# Altium schematic sheet Buck (24-5V).SchDoc (part 2 of 3)
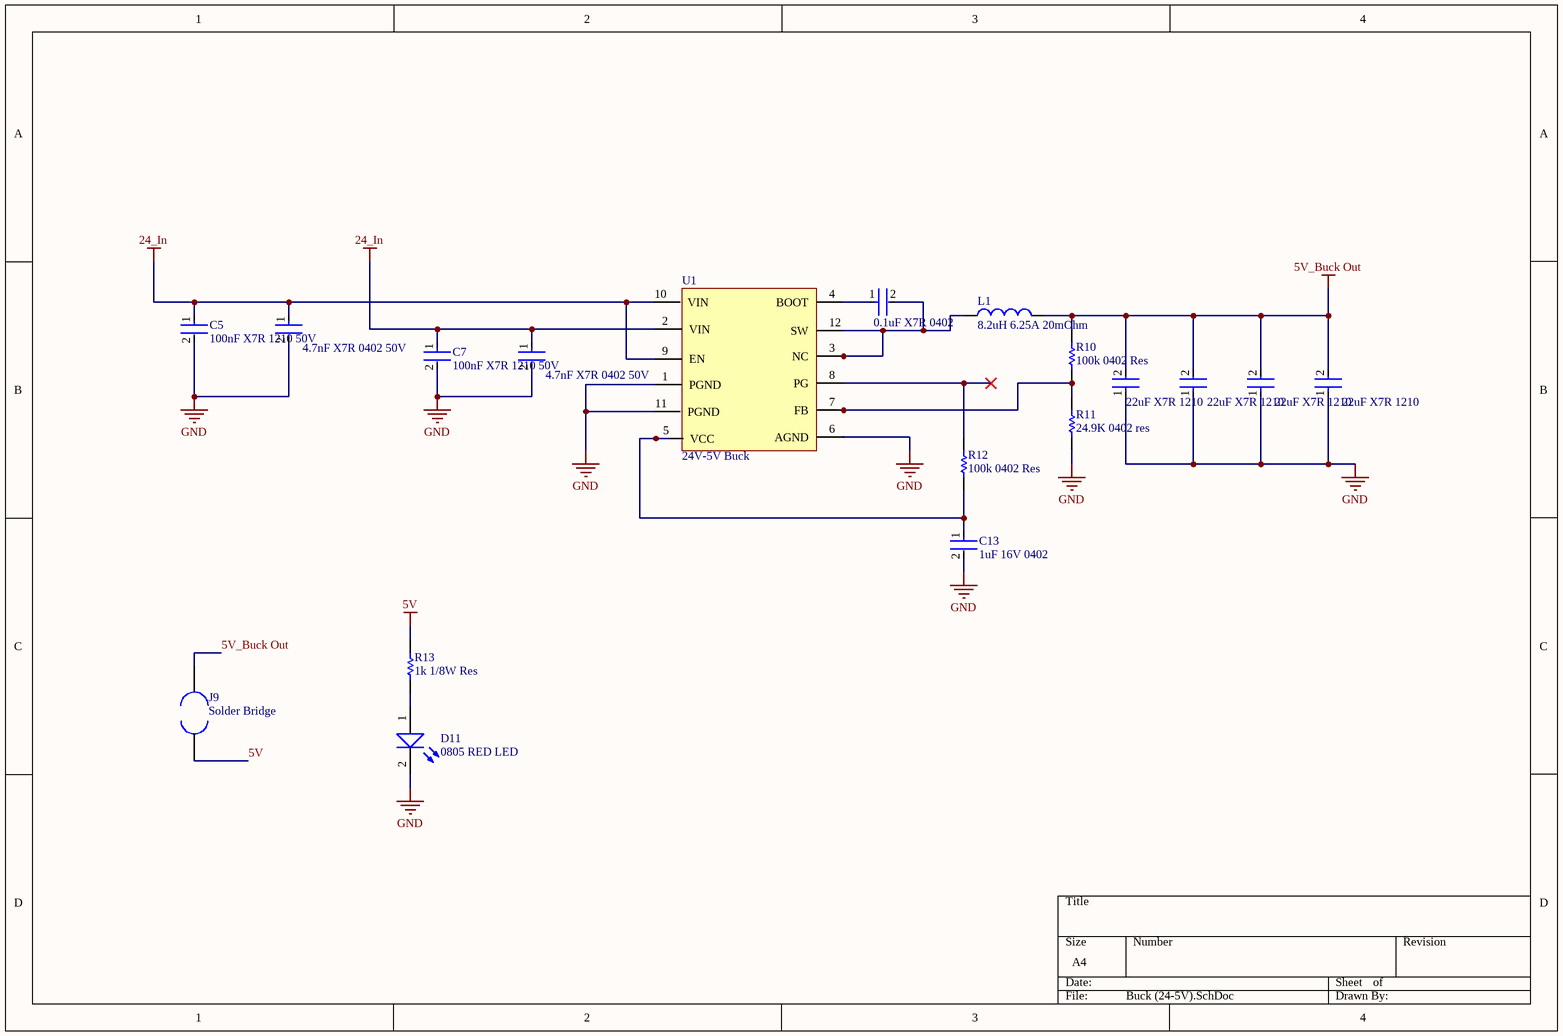
[diagram p1: Buck (24-5V).SchDoc]
## Library data of the parts
C4 = GCM155R71H104KE02J: 50V 100nF X7R ±10% 0402 Multilayer Ceramic Capacitors MLCC - SMD/SMT ROHS; Manufacturer: Murata; Manufacturer Lifecycle Status: IN PRODUCTION; Supplier: Arrow Electronics; Supplier Part Number: GCM155R71H104KE02J; Manufacturer Part Number: GCM155R71H104KE02J; RoHS: Compliant; Category: Ceramic Capacitors; Stock: 2050000; Pricing: 50000=0.008, 100000=0.0078 (USD); Value: 100nF; Case/Package: 0402; Case Code (Imperial): 0402; Case Code (Metric): 1005; Country of Origin: Philippines; Dielectric: X7R; Dielectric Material: Ceramic; Export Control Classification Number (ECCN) Code: EAR99; Height: 500µm; Harmonized Tariff Schedule (HTS) Code: 8532.24.00.20; Introduction Date: 2013-11-20; Length: 1mm; Lifecycle Status: Production; Material: Ceramic; Max Operating Temperature: 125°C; Min Operating Temperature: -55°C; Mounting Technology: Surface Mount; Number of Terminals: 2; Packaging: Tape & Reel (TR); Ratings: AEC-Q200; REACH SVHC: Yes; Schedule B: 8532240020, 8532240020|8532240020, 8532240020|8532240020|8532240020, 8532240020|8532240020|8532240020|8532240020; Termination: SMD/SMT; Tolerance: 10%; Voltage Rating: 50V; Voltage Rating (DC): 50V; Weight: 6.010099mg; Width: 500µm; ComponentLink1URL: https://datasheet.octopart.com:443/GCM155R71H104KE02J-Murata-datasheet-155345015.pdf?src-supplier=Newark; ComponentLink1Description: https://datasheet.octopart.com:443/GCM155R71H104KE02J-Murata-datasheet-155345015.pdf?src-supplier=Newark; ComponentLink2URL: https://datasheet.octopart.com:443/GCM155R71H104KE02J-Murata-datasheet-178519985.pdf?src-supplier=Arrow.cn; ComponentLink2Description: https://datasheet.octopart.com:443/GCM155R71H104KE02J-Murata-datasheet-178519985.pdf?src-supplier=Arrow.cn; ComponentLink3URL: https://datasheet.octopart.com:443/GCM155R71H104KE02J-Murata-datasheet-141266224.pdf?src-supplier=Ciiva; ComponentLink3Description: https://datasheet.octopart.com:443/GCM155R71H104KE02J-Murata-datasheet-141266224.pdf?src-supplier=Ciiva; ComponentLink4URL: https://datasheet.octopart.com:443/GCM155R71H104KE02J-Murata-datasheet-140656751.pdf?src-supplier=Ciiva; ComponentLink4Description: https://datasheet.octopart.com:443/GCM155R71H104KE02J-Murata-datasheet-140656751.pdf?src-supplier=Ciiva; ComponentLink5URL: https://datasheet.octopart.com:443/GCM155R71H104KE02J-Murata-datasheet-138716456.pdf?src-supplier=Ciiva; ComponentLink5Description: https://datasheet.octopart.com:443/GCM155R71H104KE02J-Murata-datasheet-138716456.pdf?src-supplier=Ciiva; ComponentLink6URL: https://datasheet.octopart.com:443/GCM155R71H104KE02J-Murata-datasheet-77992203.pdf?src-supplier=Future+Electronics; ComponentLink6Description: https://datasheet.octopart.com:443/GCM155R71H104KE02J-Murata-datasheet-77992203.pdf?src-supplier=Future+Electronics; ComponentLink7URL: https://datasheet.octopart.com:443/GCM155R71H104KE02J-Murata-datasheet-12511495.pdf?src-supplier=TME; ComponentLink7Description: https://datasheet.octopart.com:443/GCM155R71H104KE02J-Murata-datasheet-12511495.pdf?src-supplier=TME; ComponentLink8URL: http://sigma.octopart.com:80/reach_statement/Murata-company-16.pdf?src-supplier=Compliance+Statements; ComponentLink8Description: http://sigma.octopart.com:80/reach_statement/Murata-company-16.pdf?src-supplier=Compliance+Statements; LCSC Part No: C2649549
C5 C7 = CC1210KKX7R9BB104: 50V 100nF X7R ±10% 1210 Multilayer Ceramic Capacitors MLCC - SMD/SMT ROHS; Manufacturer: Yageo Group; Supplier: DigiKey; Supplier Part Number: 311-4522-1-ND; Manufacturer Part Number: CC1210KKX7R9BB104; RoHS: Compliant; Category: Ceramic Capacitors; Stock: 13190; Pricing: 1=0.49, 10=0.296, 50=0.221, 100=0.1979, 500=0.15896, 1000=0.14693 (USD); Value: 100nF; Case/Package: 1210; Case Code (Imperial): 1210; Case Code (Metric): 3225; China RoHS: Compliant; Composition: Ceramic; Depth: 2.5mm; Dielectric: X7R; Dielectric Material: Ceramic; Halogen Free: Halogen Free; Height: 850µm; Lead Free: Lead Free; Length: 3.2mm; Lifecycle Status: Production; Max Operating Temperature: 125°C; Min Operating Temperature: -55°C; Mounting Technology: Surface Mount; Number of Terminals: 2; Packaging: Tape and Reel; Radiation Hardening: No; REACH SVHC: Yes; Schedule B: 8532240020, 8532240020|8532240020|8532240020|8532240020|8532240020; Termination: SMD/SMT; Thickness: 939.8µm; Tolerance: 10%; Voltage Rating: 50V; Voltage Rating (DC): 50V; Width: 2.5mm; ComponentLink1URL: https://datasheet.octopart.com:443/CC1210KKX7R9BB104-Yageo-datasheet-177165144.pdf?src-supplier=IHS; ComponentLink1Description: https://datasheet.octopart.com:443/CC1210KKX7R9BB104-Yageo-datasheet-177165144.pdf?src-supplier=IHS; ComponentLink2URL: https://datasheet.octopart.com:443/CC1210KKX7R9BB104-Yageo-Group-datasheet-189192896.pdf?src-supplier=Future+Electronics; ComponentLink2Description: https://datasheet.octopart.com:443/CC1210KKX7R9BB104-Yageo-Group-datasheet-189192896.pdf?src-supplier=Future+Electronics; ComponentLink3URL: https://datasheet.octopart.com:443/CC1210KKX7R9BB104-Yageo-datasheet-166511530.pdf?src-supplier=Future+Electronics; ComponentLink3Description: https://datasheet.octopart.com:443/CC1210KKX7R9BB104-Yageo-datasheet-166511530.pdf?src-supplier=Future+Electronics; ComponentLink4URL: https://datasheet.octopart.com:443/CC1210KKX7R9BB104-Yageo-datasheet-137700082.pdf?src-supplier=Future+Electronics; ComponentLink4Description: https://datasheet.octopart.com:443/CC1210KKX7R9BB104-Yageo-datasheet-137700082.pdf?src-supplier=Future+Electronics; ComponentLink5URL: https://datasheet.octopart.com:443/CC1210KKX7R9BB104-Yageo-datasheet-137700084.pdf?src-supplier=Future+Electronics; ComponentLink5Description: https://datasheet.octopart.com:443/CC1210KKX7R9BB104-Yageo-datasheet-137700084.pdf?src-supplier=Future+Electronics; ComponentLink6URL: https://datasheet.octopart.com:443/CC1210KKX7R9BB104-Yageo-datasheet-27626582.pdf?src-supplier=Future+Electronics; ComponentLink6Description: https://datasheet.octopart.com:443/CC1210KKX7R9BB104-Yageo-datasheet-27626582.pdf?src-supplier=Future+Electronics; ComponentLink7URL: https://datasheet.octopart.com:443/CC1210KKX7R9BB104-Yageo-datasheet-15895757.pdf?src-supplier=Future+Electronics; ComponentLink7Description: https://datasheet.octopart.com:443/CC1210KKX7R9BB104-Yageo-datasheet-15895757.pdf?src-supplier=Future+Electronics; ComponentLink8URL: https://datasheet.octopart.com:443/CC1210KKX7R9BB104-Yageo-datasheet-181971219.pdf?src-supplier=Newark; ComponentLink8Description: https://datasheet.octopart.com:443/CC1210KKX7R9BB104-Yageo-datasheet-181971219.pdf?src-supplier=Newark; ComponentLink9URL: https://datasheet.octopart.com/CC1210KKX7R9BB104-Yageo-datasheet-10883670.pdf; ComponentLink9Description: https://datasheet.octopart.com/CC1210KKX7R9BB104-Yageo-datasheet-10883670.pdf; ComponentLink10URL: https://datasheet.octopart.com/CC1210KKX7R9BB104-Yageo-datasheet-12526321.pdf; ComponentLink10Description: https://datasheet.octopart.com/CC1210KKX7R9BB104-Yageo-datasheet-12526321.pdf; ComponentLink11URL: https://datasheet.octopart.com:443/CC1210KKX7R9BB104-Yageo-Group-datasheet-165992755.pdf?src-supplier=ODG+(Origin+Data+Global); ComponentLink11Description: https://datasheet.octopart.com:443/CC1210KKX7R9BB104-Yageo-Group-datasheet-165992755.pdf?src-supplier=ODG+(Origin+Data+Global); ComponentLink12URL: http://sigma.octopart.com:80/rohs_statement/Surface-Mount-Ceramic-Multilayer-Capacitors%3B-General-Purpose-%26-High-Capacitance-Class-2%2C-X7R-Yageo-family-124.pdf?src-supplier=Compliance+Statements; ComponentLink12Description: http://sigma.octopart.com:80/rohs_statement/Surface-Mount-Ceramic-Multilayer-Capacitors%3B-General-Purpose-%26-High-Capacitance-Class-2%2C-X7R-Yageo-family-124.pdf?src-supplier=Compliance+Statements; ComponentLink13URL: http://sigma.octopart.com:80/reach_statement/Surface-Mount-Ceramic-Multilayer-Capacitors%3B-General-Purpose-%26-High-Capacitance-Class-2%2C-X7R-Yageo-family-125.pdf?src-supplier=Compliance+Statements; ComponentLink13Description: http://sigma.octopart.com:80/reach_statement/Surface-Mount-Ceramic-Multilayer-Capacitors%3B-General-Purpose-%26-High-Capacitance-Class-2%2C-X7R-Yageo-family-125.pdf?src-supplier=Compliance+Statements; ComponentLink14URL: http://sigma.octopart.com:80/conflict_mineral_statement/Yageo-company-3.pdf?src-supplier=Compliance+Statements; ComponentLink14Description: http://sigma.octopart.com:80/conflict_mineral_statement/Yageo-company-3.pdf?src-supplier=Compliance+Statements; ComponentLink15URL: http://sigma.octopart.com:80/rohs_statement/Yageo-company-2.pdf?src-supplier=Compliance+Statements; ComponentLink15Description: http://sigma.octopart.com:80/rohs_statement/Yageo-company-2.pdf?src-supplier=Compliance+Statements; LCSC Part No: C412504
C6 C8 = C0402C472J5RECTU: Multilayer Ceramic Capacitors MLCC - SMD/SMT 50V 4700pF X7R 0402 5%; Manufacturer: Yageo Group; Supplier: DigiKey; Supplier Part Number: 399-C0402C472J5RECTUCT-ND; Manufacturer Part Number: C0402C472J5RECTU; RoHS: Compliant; Category: Ceramic Capacitors; Stock: 10769; Pricing: 1=0.13, 10=0.072, 50=0.0504, 100=0.0437, 500=0.03246, 1000=0.02899, 2500=0.02536, 5000=0.02317 (USD); Value: 4.7nF; Case/Package: 0402; China RoHS: Compliant; Country of Origin: Mexico; Dielectric Material: Ceramic; Export Control Classification Number (ECCN) Code: EAR99; Height: 500µm; Harmonized Tariff Schedule (HTS) Code: 8532.24.00.20; Introduction Date: 2018-03-06; Length: 1mm; Lifecycle Status: Production; Max Operating Temperature: 125°C; Min Operating Temperature: -55°C; Mounting Technology: Surface Mount; Number of Terminals: 2; REACH SVHC: Yes; Voltage Rating (DC): 50V; Width: 500µm; ComponentLink1URL: https://datasheet.octopart.com:443/C0402C472J5RECTU-KEMET-datasheet-178568699.pdf?src-supplier=IHS; ComponentLink1Description: https://datasheet.octopart.com:443/C0402C472J5RECTU-KEMET-datasheet-178568699.pdf?src-supplier=IHS; ComponentLink2URL: https://datasheet.octopart.com:443/C0402C472J5RECTU-KEMET-datasheet-189885673.pdf?src-supplier=element14+APAC; ComponentLink2Description: https://datasheet.octopart.com:443/C0402C472J5RECTU-KEMET-datasheet-189885673.pdf?src-supplier=element14+APAC; LCSC Part No: C6117713
C9-C12 = CL32B226MOJNNNE: 16V 22uF X7R 卤20% 1210 Multilayer Ceramic Capacitors MLCC - SMD/SMT ROHS; Manufacturer: Samsung Electro-Mechanics; Value: 22µF; Tolerance: 20%; Supplier: Future Electronics; Supplier Part Number: CL32B226MOJNNNE; Manufacturer Part Number: CL32B226MOJNNNE; RoHS: Compliant; Category: Ceramic Capacitors; Stock: 33000; Pricing: 1000=0.0959, 3000=0.0934, 5000=0.0923, 20000=0.0892, 30000=0.0873 (USD); Case/Package: 1210; Case Code (Imperial): 1210; Case Code (Metric): 3225; China RoHS: Compliant; Country of Origin: Mainland China, Philippines, South Korea; Depth: 2.5mm; Dielectric: X7R; Dielectric Material: Ceramic; Export Control Classification Number (ECCN) Code: EAR99; Height: 2.8mm; Harmonized Tariff Schedule (HTS) Code: 8532.24.00.20; Introduction Date: 2010-04-14; Length: 3.2mm; Lifecycle Status: Production; Material: Ceramic; Max Operating Temperature: 125°C; Min Operating Temperature: -55°C; Mounting Technology: Surface Mount; Number of Terminals: 2; Packaging: Tape & Reel; Radiation Hardening: No; REACH SVHC: Yes; Schedule B: 8532240020, 8532240020|8532240020, 8532240020|8532240020|8532240020, 8532240020|8532240020|8532240020|8532240020; Thickness: 2.6924mm; Voltage Rating: 16V; Voltage Rating (DC): 16V; Width: 2.4892mm; ComponentLink1URL: https://datasheet.octopart.com:443/CL32B226MOJNNNE-Samsung-Electro-Mechanics-datasheet-136482671.pdf?src-supplier=IHS; ComponentLink1Description: https://datasheet.octopart.com:443/CL32B226MOJNNNE-Samsung-Electro-Mechanics-datasheet-136482671.pdf?src-supplier=IHS; ComponentLink2URL: https://datasheet.octopart.com:443/CL32B226MOJNNNE-Samsung-Electro-Mechanics-datasheet-149049213.pdf?src-supplier=Future+Electronics; ComponentLink2Description: https://datasheet.octopart.com:443/CL32B226MOJNNNE-Samsung-Electro-Mechanics-datasheet-149049213.pdf?src-supplier=Future+Electronics; ComponentLink3URL: https://datasheet.octopart.com:443/CL32B226MOJNNNE-Samsung-Electro-Mechanics-datasheet-116051344.pdf?src-supplier=Future+Electronics; ComponentLink3Description: https://datasheet.octopart.com:443/CL32B226MOJNNNE-Samsung-Electro-Mechanics-datasheet-116051344.pdf?src-supplier=Future+Electronics; ComponentLink4URL: https://datasheet.octopart.com:443/CL32B226MOJNNNE-Samsung-Electro-Mechanics-datasheet-81462651.pdf?src-supplier=Future+Electronics; ComponentLink4Description: https://datasheet.octopart.com:443/CL32B226MOJNNNE-Samsung-Electro-Mechanics-datasheet-81462651.pdf?src-supplier=Future+Electronics; ComponentLink5URL: https://datasheet.octopart.com:443/CL32B226MOJNNNE-Samsung-datasheet-26673912.pdf?src-supplier=Future+Electronics; ComponentLink5Description: https://datasheet.octopart.com:443/CL32B226MOJNNNE-Samsung-datasheet-26673912.pdf?src-supplier=Future+Electronics; ComponentLink6URL: https://datasheet.octopart.com:443/CL32B226MOJNNNE-Samsung-datasheet-37081328.pdf?src-supplier=Future+Electronics; ComponentLink6Description: https://datasheet.octopart.com:443/CL32B226MOJNNNE-Samsung-datasheet-37081328.pdf?src-supplier=Future+Electronics; ComponentLink7URL: https://datasheet.octopart.com/CL32B226MOJNNNE-Samsung-Electro-Mechanics-datasheet-97040617.pdf; ComponentLink7Description: https://datasheet.octopart.com/CL32B226MOJNNNE-Samsung-Electro-Mechanics-datasheet-97040617.pdf; ComponentLink8URL: https://datasheet.octopart.com/CL32B226MOJNNNE-Samsung-Electro-Mechanics-datasheet-8324245.pdf; ComponentLink8Description: https://datasheet.octopart.com/CL32B226MOJNNNE-Samsung-Electro-Mechanics-datasheet-8324245.pdf; ComponentLink9URL: https://datasheet.octopart.com/General-Multilayer-Ceramic-Capacitors-Samsung-datasheet-family-111.pdf; ComponentLink9Description: https://datasheet.octopart.com/General-Multilayer-Ceramic-Capacitors-Samsung-datasheet-family-111.pdf; ComponentLink10URL: http://sigma.octopart.com:80/rohs_certificate/General-Multilayer-Ceramic-Capacitors-Samsung-family-110.pdf?src-supplier=Compliance+Statements; ComponentLink10Description: http://sigma.octopart.com:80/rohs_certificate/General-Multilayer-Ceramic-Capacitors-Samsung-family-110.pdf?src-supplier=Compliance+Statements; ComponentLink11URL: http://sigma.octopart.com:80/rohs_statement/General-Multilayer-Ceramic-Capacitors-Samsung-family-132.pdf?src-supplier=Compliance+Statements; ComponentLink11Description: http://sigma.octopart.com:80/rohs_statement/General-Multilayer-Ceramic-Capacitors-Samsung-family-132.pdf?src-supplier=Compliance+Statements; ComponentLink12URL: http://sigma.octopart.com:80/reach_statement/General-Multilayer-Ceramic-Capacitors-Samsung-family-133.pdf?src-supplier=Compliance+Statements; ComponentLink12Description: http://sigma.octopart.com:80/reach_statement/General-Multilayer-Ceramic-Capacitors-Samsung-family-133.pdf?src-supplier=Compliance+Statements; LCSC Part No: C2980161
C13 = CC0402KRX7R7BB104: 16V 1uF X5R 卤10% 0402 Multilayer Ceramic Capacitors MLCC - SMD/SMT ROHS; Manufacturer: Yageo Group; Value: 100nF; Dielectric: X7R; Temperature Coefficient: 30ppm/°C; Tolerance: 10%; Supplier: Future Electronics; Supplier Part Number: CC0402KRX7R7BB104; Manufacturer Part Number: CC0402KRX7R7BB104; RoHS: Compliant; Category: Ceramic Capacitors; Stock: 75670000; Pricing: 20000=0.0011, 100000=0.001, 250000=0.001, 750000=0.001, 1500000=0.0009 (USD); Case/Package: 0402; Case Code (Imperial): 0402; Case Code (Metric): 1005; China RoHS: Compliant; Composition: Ceramic; Country of Origin: Mainland China, Taiwan; Depth: 500µm; Dielectric Material: Ceramic; Export Control Classification Number (ECCN) Code: EAR99; Halogen Free: Halogen Free; Height: 500µm; Harmonized Tariff Schedule (HTS) Code: 8532.24.00.20; Introduction Date: 2009-04-17; Lead Free: Lead Free; Length: 1mm; Lifecycle Status: Production; Material: Ceramic; Max Operating Temperature: 125°C; Min Operating Temperature: -55°C; Mounting Technology: Surface Mount; Pins: 2; Number of Terminals: 2; Radiation Hardening: No; REACH SVHC: Yes; Schedule B: 8532240020, 8532240020|8532240020, 8532240020|8532240020|8532240020, 8532240020|8532240020|8532240020|8532240020; Termination: SMD/SMT; Thickness: 558.8µm; Voltage: 16V; Voltage Rating: 16V; Voltage Rating (AC): 16V; Voltage Rating (DC): 16V; Width: 500µm; ComponentLink1URL: https://datasheet.octopart.com:443/CC0402KRX7R7BB104-Yageo-datasheet-177165144.pdf?src-supplier=IHS; ComponentLink1Description: https://datasheet.octopart.com:443/CC0402KRX7R7BB104-Yageo-datasheet-177165144.pdf?src-supplier=IHS; ComponentLink2URL: https://datasheet.octopart.com/CC0402KRX7R7BB104-Yageo-datasheet-10883670.pdf; ComponentLink2Description: https://datasheet.octopart.com/CC0402KRX7R7BB104-Yageo-datasheet-10883670.pdf; ComponentLink3URL: https://datasheet.octopart.com/CC0402KRX7R7BB104-Yageo-datasheet-12526321.pdf; ComponentLink3Description: https://datasheet.octopart.com/CC0402KRX7R7BB104-Yageo-datasheet-12526321.pdf; ComponentLink4URL: https://datasheet.octopart.com:443/CC0402KRX7R7BB104-Yageo-datasheet-82288757.pdf?src-supplier=Upverter; ComponentLink4Description: https://datasheet.octopart.com:443/CC0402KRX7R7BB104-Yageo-datasheet-82288757.pdf?src-supplier=Upverter; ComponentLink5URL: https://datasheet.octopart.com:443/CC0402KRX7R7BB104-Yageo-datasheet-78855684.pdf?src-supplier=Upverter; ComponentLink5Description: https://datasheet.octopart.com:443/CC0402KRX7R7BB104-Yageo-datasheet-78855684.pdf?src-supplier=Upverter; ComponentLink6URL: https://datasheet.octopart.com:443/CC0402KRX7R7BB104-Yageo-datasheet-68298032.pdf?src-supplier=Upverter; ComponentLink6Description: https://datasheet.octopart.com:443/CC0402KRX7R7BB104-Yageo-datasheet-68298032.pdf?src-supplier=Upverter; ComponentLink7URL: https://datasheet.octopart.com:443/CC0402KRX7R7BB104-Yageo-datasheet-181967370.pdf?src-supplier=Newark; ComponentLink7Description: https://datasheet.octopart.com:443/CC0402KRX7R7BB104-Yageo-datasheet-181967370.pdf?src-supplier=Newark; ComponentLink8URL: https://datasheet.octopart.com:443/CC0402KRX7R7BB104-Yageo-datasheet-181967368.pdf?src-supplier=Newark; ComponentLink8Description: https://datasheet.octopart.com:443/CC0402KRX7R7BB104-Yageo-datasheet-181967368.pdf?src-supplier=Newark; ComponentLink9URL: https://datasheet.octopart.com:443/CC0402KRX7R7BB104-Yageo-datasheet-499490.pdf?src-supplier=Newark; ComponentLink9Description: https://datasheet.octopart.com:443/CC0402KRX7R7BB104-Yageo-datasheet-499490.pdf?src-supplier=Newark; ComponentLink10URL: https://datasheet.octopart.com:443/CC0402KRX7R7BB104-Yageo-datasheet-519481.pdf?src-supplier=Newark; ComponentLink10Description: https://datasheet.octopart.com:443/CC0402KRX7R7BB104-Yageo-datasheet-519481.pdf?src-supplier=Newark; ComponentLink11URL: https://datasheet.octopart.com:443/CC0402KRX7R7BB104-Yageo-datasheet-182050774.pdf?src-supplier=Newark; ComponentLink11Description: https://datasheet.octopart.com:443/CC0402KRX7R7BB104-Yageo-datasheet-182050774.pdf?src-supplier=Newark; ComponentLink12URL: https://datasheet.octopart.com:443/CC0402KRX7R7BB104-Yageo-datasheet-62336348.pdf?src-supplier=Farnell; ComponentLink12Description: https://datasheet.octopart.com:443/CC0402KRX7R7BB104-Yageo-datasheet-62336348.pdf?src-supplier=Farnell; ComponentLink13URL: https://datasheet.octopart.com:443/CC0402KRX7R7BB104-Yageo-datasheet-151948686.pdf?src-supplier=Farnell; ComponentLink13Description: https://datasheet.octopart.com:443/CC0402KRX7R7BB104-Yageo-datasheet-151948686.pdf?src-supplier=Farnell; ComponentLink14URL: https://datasheet.octopart.com:443/CC0402KRX7R7BB104-Yageo-Group-datasheet-188689702.pdf?src-supplier=Farnell; ComponentLink14Description: https://datasheet.octopart.com:443/CC0402KRX7R7BB104-Yageo-Group-datasheet-188689702.pdf?src-supplier=Farnell; ComponentLink15URL: https://datasheet.octopart.com:443/CC0402KRX7R7BB104-Yageo-datasheet-8359971.pdf?src-supplier=Farnell; ComponentLink15Description: https://datasheet.octopart.com:443/CC0402KRX7R7BB104-Yageo-datasheet-8359971.pdf?src-supplier=Farnell; ComponentLink16URL: https://datasheet.octopart.com:443/CC0402KRX7R7BB104-Yageo-datasheet-500777.pdf?src-supplier=Farnell; ComponentLink16Description: https://datasheet.octopart.com:443/CC0402KRX7R7BB104-Yageo-datasheet-500777.pdf?src-supplier=Farnell; ComponentLink17URL: https://datasheet.octopart.com:443/CC0402KRX7R7BB104-Yageo-datasheet-137700084.pdf?src-supplier=Burklin+Elektronik; ComponentLink17Description: https://datasheet.octopart.com:443/CC0402KRX7R7BB104-Yageo-datasheet-137700084.pdf?src-supplier=Burklin+Elektronik; ComponentLink18URL: https://datasheet.octopart.com:443/CC0402KRX7R7BB104-Yageo-datasheet-27626582.pdf?src-supplier=Future+Electronics; ComponentLink18Description: https://datasheet.octopart.com:443/CC0402KRX7R7BB104-Yageo-datasheet-27626582.pdf?src-supplier=Future+Electronics; ComponentLink19URL: https://datasheet.octopart.com:443/CC0402KRX7R7BB104-Yageo-datasheet-166511530.pdf?src-supplier=Future+Electronics; ComponentLink19Description: https://datasheet.octopart.com:443/CC0402KRX7R7BB104-Yageo-datasheet-166511530.pdf?src-supplier=Future+Electronics; ComponentLink20URL: https://datasheet.octopart.com:443/CC0402KRX7R7BB104-Yageo-datasheet-137700082.pdf?src-supplier=Future+Electronics; ComponentLink20Description: https://datasheet.octopart.com:443/CC0402KRX7R7BB104-Yageo-datasheet-137700082.pdf?src-supplier=Future+Electronics; ComponentLink21URL: https://datasheet.octopart.com:443/CC0402KRX7R7BB104-Yageo-datasheet-24578986.pdf?src-supplier=Future+Electronics; ComponentLink21Description: https://datasheet.octopart.com:443/CC0402KRX7R7BB104-Yageo-datasheet-24578986.pdf?src-supplier=Future+Electronics; ComponentLink22URL: https://datasheet.octopart.com:443/CC0402KRX7R7BB104-Yageo-datasheet-10911834.pdf?src-supplier=Future+Electronics; ComponentLink22Description: https://datasheet.octopart.com:443/CC0402KRX7R7BB104-Yageo-datasheet-10911834.pdf?src-supplier=Future+Electronics; ComponentLink23URL: https://datasheet.octopart.com:443/CC0402KRX7R7BB104-Yageo-datasheet-8324442.pdf?src-supplier=Future+Electronics; ComponentLink23Description: https://datasheet.octopart.com:443/CC0402KRX7R7BB104-Yageo-datasheet-8324442.pdf?src-supplier=Future+Electronics; ComponentLink24URL: https://datasheet.octopart.com:443/CC0402KRX7R7BB104-Yageo-datasheet-15895757.pdf?src-supplier=element14+APAC; ComponentLink24Description: https://datasheet.octopart.com:443/CC0402KRX7R7BB104-Yageo-datasheet-15895757.pdf?src-supplier=element14+APAC; ComponentLink25URL: https://datasheet.octopart.com:443/CC0402KRX7R7BB104-Yageo-Group-datasheet-165992755.pdf?src-supplier=ODG+(Origin+Data+Global); ComponentLink25Description: https://datasheet.octopart.com:443/CC0402KRX7R7BB104-Yageo-Group-datasheet-165992755.pdf?src-supplier=ODG+(Origin+Data+Global); ComponentLink26URL: https://datasheet.octopart.com:443/CC0402KRX7R7BB104-Yageo-datasheet-140260305.pdf?src-supplier=SOS+electronic; ComponentLink26Description: https://datasheet.octopart.com:443/CC0402KRX7R7BB104-Yageo-datasheet-140260305.pdf?src-supplier=SOS+electronic; ComponentLink27URL: https://datasheet.octopart.com:443/CC0402KRX7R7BB104-Yageo-datasheet-151978998.pdf?src-supplier=SOS+electronic; ComponentLink27Description: https://datasheet.octopart.com:443/CC0402KRX7R7BB104-Yageo-datasheet-151978998.pdf?src-supplier=SOS+electronic; ComponentLink28URL: https://datasheet.octopart.com:443/CC0402KRX7R7BB104-Yageo-datasheet-8701427.pdf?src-supplier=element14; ComponentLink28Description: https://datasheet.octopart.com:443/CC0402KRX7R7BB104-Yageo-datasheet-8701427.pdf?src-supplier=element14; ComponentLink29URL: https://datasheet.octopart.com:443/CC0402KRX7R7BB104-Yageo-datasheet-5301394.pdf?src-supplier=element14; ComponentLink29Description: https://datasheet.octopart.com:443/CC0402KRX7R7BB104-Yageo-datasheet-5301394.pdf?src-supplier=element14; ComponentLink30URL: http://sigma.octopart.com:80/rohs_statement/Surface-Mount-Ceramic-Multilayer-Capacitors%3B-General-Purpose-%26-High-Capacitance-Class-2%2C-X7R-Yageo-family-124.pdf?src-supplier=Compliance+Statements; ComponentLink30Description: http://sigma.octopart.com:80/rohs_statement/Surface-Mount-Ceramic-Multilayer-Capacitors%3B-General-Purpose-%26-High-Capacitance-Class-2%2C-X7R-Yageo-family-124.pdf?src-supplier=Compliance+Statements; ComponentLink31URL: http://sigma.octopart.com:80/reach_statement/Surface-Mount-Ceramic-Multilayer-Capacitors%3B-General-Purpose-%26-High-Capacitance-Class-2%2C-X7R-Yageo-family-125.pdf?src-supplier=Compliance+Statements; ComponentLink31Description: http://sigma.octopart.com:80/reach_statement/Surface-Mount-Ceramic-Multilayer-Capacitors%3B-General-Purpose-%26-High-Capacitance-Class-2%2C-X7R-Yageo-family-125.pdf?src-supplier=Compliance+Statements; ComponentLink32URL: http://sigma.octopart.com:80/conflict_mineral_statement/Yageo-company-3.pdf?src-supplier=Compliance+Statements; ComponentLink32Description: http://sigma.octopart.com:80/conflict_mineral_statement/Yageo-company-3.pdf?src-supplier=Compliance+Statements; ComponentLink33URL: http://sigma.octopart.com:80/rohs_statement/Yageo-company-2.pdf?src-supplier=Compliance+Statements; ComponentLink33Description: http://sigma.octopart.com:80/rohs_statement/Yageo-company-2.pdf?src-supplier=Compliance+Statements; Contact Plating: Tin; ComponentLink34URL: https://datasheet.octopart.com:443/CL05A105KO5NNNC-Samsung-Electro-Mechanics-datasheet-181960514.pdf?src-supplier=IHS; ComponentLink34Description: https://datasheet.octopart.com:443/CL05A105KO5NNNC-Samsung-Electro-Mechanics-datasheet-181960514.pdf?src-supplier=IHS; ComponentLink35URL: https://datasheet.octopart.com:443/CL05A105KO5NNNC-Samsung-Electro-Mechanics-datasheet-136031720.pdf?src-supplier=Samsung+SCT; ComponentLink35Description: https://datasheet.octopart.com:443/CL05A105KO5NNNC-Samsung-Electro-Mechanics-datasheet-136031720.pdf?src-supplier=Samsung+SCT; ComponentLink36URL: https://datasheet.octopart.com:443/CL05A105KO5NNNC-Samsung-Electro-Mechanics-datasheet-11776774.pdf?src-supplier=Future+Electronics; ComponentLink36Description: https://datasheet.octopart.com:443/CL05A105KO5NNNC-Samsung-Electro-Mechanics-datasheet-11776774.pdf?src-supplier=Future+Electronics; ComponentLink37URL: https://datasheet.octopart.com:443/CL05A105KO5NNNC-Samsung-Electro-Mechanics-datasheet-110226202.pdf?src-supplier=Future+Electronics; ComponentLink37Description: https://datasheet.octopart.com:443/CL05A105KO5NNNC-Samsung-Electro-Mechanics-datasheet-110226202.pdf?src-supplier=Future+Electronics; ComponentLink38URL: https://datasheet.octopart.com:443/CL05A105KO5NNNC-Samsung-Electro-Mechanics-datasheet-81461590.pdf?src-supplier=Future+Electronics; ComponentLink38Description: https://datasheet.octopart.com:443/CL05A105KO5NNNC-Samsung-Electro-Mechanics-datasheet-81461590.pdf?src-supplier=Future+Electronics; ComponentLink39URL: https://datasheet.octopart.com:443/CL05A105KO5NNNC-Samsung-datasheet-42280519.pdf?src-supplier=Future+Electronics; ComponentLink39Description: https://datasheet.octopart.com:443/CL05A105KO5NNNC-Samsung-datasheet-42280519.pdf?src-supplier=Future+Electronics; ComponentLink40URL: https://datasheet.octopart.com:443/CL05A105KO5NNNC-Samsung-datasheet-34152987.pdf?src-supplier=Future+Electronics; ComponentLink40Description: https://datasheet.octopart.com:443/CL05A105KO5NNNC-Samsung-datasheet-34152987.pdf?src-supplier=Future+Electronics; ComponentLink41URL: https://datasheet.octopart.com:443/CL05A105KO5NNNC-Samsung-datasheet-8329584.pdf?src-supplier=Future+Electronics; ComponentLink41Description: https://datasheet.octopart.com:443/CL05A105KO5NNNC-Samsung-datasheet-8329584.pdf?src-supplier=Future+Electronics; ComponentLink42URL: https://datasheet.octopart.com:443/CL05A105KO5NNNC-Samsung-Electro-Mechanics-datasheet-149136633.pdf?src-supplier=Future+Electronics; ComponentLink42Description: https://datasheet.octopart.com:443/CL05A105KO5NNNC-Samsung-Electro-Mechanics-datasheet-149136633.pdf?src-supplier=Future+Electronics; ComponentLink43URL: https://datasheet.octopart.com/CL05A105KO5NNNC-Samsung-Electro-Mechanics-datasheet-97040617.pdf; ComponentLink43Description: https://datasheet.octopart.com/CL05A105KO5NNNC-Samsung-Electro-Mechanics-datasheet-97040617.pdf; ComponentLink44URL: https://datasheet.octopart.com/CL05A105KO5NNNC-Samsung-Electro-Mechanics-datasheet-8324245.pdf; ComponentLink44Description: https://datasheet.octopart.com/CL05A105KO5NNNC-Samsung-Electro-Mechanics-datasheet-8324245.pdf; ComponentLink45URL: https://datasheet.octopart.com:443/CL05A105KO5NNNC-Samsung-datasheet-59220082.pdf?src-supplier=TME; ComponentLink45Description: https://datasheet.octopart.com:443/CL05A105KO5NNNC-Samsung-datasheet-59220082.pdf?src-supplier=TME; LCSC Part No: C29266
D11 = SML-LXT0805IW-TR: Led; Red; 11MCD; 0.061IN.DIA.; SMD; 100MA; 2V Vf; 635NM; 140DEG; SMD; White Diffused; 5V Vr; Manufacturer: Lumex; Approvals: CSA, UL; Forward Current: 30mA; Forward Voltage: 2.5V; Number of Circuits: 1; Power Dissipation: 48mW; Shape: Rectangular; Test Current: 20mA; Viewing Angle: 140°; Wavelength: 628nm; Supplier: DigiKey; Supplier Part Number: 67-1552-1-ND; Manufacturer Part Number: SML-LXT0805IW-TR; RoHS: Compliant; Category: LEDs; Stock: 136451; Pricing: 1=0.2, 10=0.138, 100=0.0958, 500=0.07648, 1000=0.07007, 2000=0.06459 (USD); Case/Package: 0805; Case Code (Imperial): 0805; Case Code (Metric): 2012; China RoHS: Compliant; Color: Red; Country of Origin: Taiwan; Dominant Wavelength: 635nm; Export Control Classification Number (ECCN) Code: EAR99; Height: 800µm; Harmonized Tariff Schedule (HTS) Code: 8541.40.20.00; Illumination Color: Red; Introduction Date: 2001-01-08; Length: 2mm; Lens Color: White; Lens Style: Diffused; Lens Transparency: Diffused; Lifecycle Status: Production; Luminous Intensity: 11mcd; Max Operating Temperature: 80°C; Min Operating Temperature: -25°C; Mounting Technology: Surface Mount; Number of LEDs: 1; Pins: 2; Number of Terminals: 2; Packaging: Cut Tape; Peak Wavelength: 635nm; REACH SVHC: Yes; Reverse Voltage: 5V; Schedule B: 8541402000, 8541402000|8541402000|8541402000|8541402000|8541402000|8541402000|8541402000|8541402000|8541402000|8541402000|8541402000|8541402000|8541402000|8541402000|8541402000|8541402000|8541402000|8541402000|8541402000|8541402000|8541402000|8541402000|8541402000|85, 8541410000; Terminal Pitch: 2.1mm; Width: 1.25mm; ComponentLink1URL: https://datasheet.octopart.com:443/SML-LXT0805IW-TR-Lumex-datasheet-96443416.pdf?src-supplier=JRH+Electronics; ComponentLink1Description: https://datasheet.octopart.com:443/SML-LXT0805IW-TR-Lumex-datasheet-96443416.pdf?src-supplier=JRH+Electronics; ComponentLink2URL: https://datasheet.octopart.com:443/SML-LXT0805IW-TR-Lumex-datasheet-158251.pdf?src-supplier=Newark; ComponentLink2Description: https://datasheet.octopart.com:443/SML-LXT0805IW-TR-Lumex-datasheet-158251.pdf?src-supplier=Newark; ComponentLink3URL: https://datasheet.octopart.com:443/SML-LXT0805IW-TR-Lumex-datasheet-43153349.pdf?src-supplier=Electro+Sonic; ComponentLink3Description: https://datasheet.octopart.com:443/SML-LXT0805IW-TR-Lumex-datasheet-43153349.pdf?src-supplier=Electro+Sonic; ComponentLink4URL: https://datasheet.octopart.com:443/SML-LXT0805IW-TR.-Lumex-datasheet-17067.pdf?src-supplier=DigiKey; ComponentLink4Description: https://datasheet.octopart.com:443/SML-LXT0805IW-TR.-Lumex-datasheet-17067.pdf?src-supplier=DigiKey; ComponentLink5URL: https://datasheet.octopart.com:443/SML-LXT0805IW-TR-Lumex-datasheet-9793472.pdf?src-supplier=RS+(Formerly+Allied+Electronics); ComponentLink5Description: https://datasheet.octopart.com:443/SML-LXT0805IW-TR-Lumex-datasheet-9793472.pdf?src-supplier=RS+(Formerly+Allied+Electronics); ComponentLink6URL: https://datasheet.octopart.com:443/SML-LXT0805IW-TR-Lumex-datasheet-86237.pdf?src-supplier=RS+(Formerly+Allied+Electronics); ComponentLink6Description: https://datasheet.octopart.com:443/SML-LXT0805IW-TR-Lumex-datasheet-86237.pdf?src-supplier=RS+(Formerly+Allied+Electronics); LCSC Part No: C19171391
L1 = 744771008: Power Inductor, SMT, 1260, 8.2 Uh, 6.25 A, .02 Ohm, Fixed, We-pd Series; Manufacturer: Wurth Elektronik; Core Material: Ferrite; Current Rating: 6.2A; DC Resistance (DCR): 15.5mΩ; Value: 8.2µH; Inductance Tolerance: 20%; Self Resonant Frequency: 25MHz; ESR: 20mΩ; Shielding: Shielded; Test Frequency: 1kHz; Supplier: DigiKey; Supplier Part Number: 732-1207-1-ND; Manufacturer Part Number: 744771008; RoHS: Compliant; Category: Fixed Inductors; Stock: 330; Pricing: 1=2.26, 10=2.172, 50=1.961, 100=1.759, 250=1.61 (USD); Ambient Temperature Range High: 85°C; Ambient Temperature Range Low: -40°C; Case/Package: Nonstandard; Composition: Wirewound; Depth: 12mm; Height: 6mm; Height - Seated (Max): 5.9944mm; Lead Free: Lead Free; Length: 12mm; Max DC Current: 6.25A; Max Operating Temperature: 125°C; Min Operating Temperature: -40°C; Mounting Technology: Surface Mount; Pins: 2; RMS Current (Irms): 6.25A; Saturation Current: 6.2A; Termination: SMD/SMT; Tolerance: 20%; Weight: 4.535924g; Width: 12mm; ComponentLink1URL: https://datasheet.octopart.com:443/744771008-Wurth-Elektronik-datasheet-168492728.pdf?src-supplier=Wurth+Elektronik; ComponentLink1Description: https://datasheet.octopart.com:443/744771008-Wurth-Elektronik-datasheet-168492728.pdf?src-supplier=Wurth+Elektronik; ComponentLink2URL: https://datasheet.octopart.com:443/744771008-W%C3%BCrth-Elektronik-datasheet-142051527.pdf?src-supplier=Farnell; ComponentLink2Description: https://datasheet.octopart.com:443/744771008-W%C3%BCrth-Elektronik-datasheet-142051527.pdf?src-supplier=Farnell; ComponentLink3URL: https://datasheet.octopart.com:443/744771008-W%C3%BCrth-Elektronik-Midcom-datasheet-5337310.pdf?src-supplier=Farnell; ComponentLink3Description: https://datasheet.octopart.com:443/744771008-W%C3%BCrth-Elektronik-Midcom-datasheet-5337310.pdf?src-supplier=Farnell; ComponentLink4URL: https://datasheet.octopart.com:443/744771008-W%C3%BCrth-Elektronik-datasheet-17695912.pdf?src-supplier=HQonline; ComponentLink4Description: https://datasheet.octopart.com:443/744771008-W%C3%BCrth-Elektronik-datasheet-17695912.pdf?src-supplier=HQonline; ComponentLink5URL: https://datasheet.octopart.com:443/744771008-W%C3%BCrth-Elektronik-datasheet-41343275.pdf?src-supplier=element14+APAC; ComponentLink5Description: https://datasheet.octopart.com:443/744771008-W%C3%BCrth-Elektronik-datasheet-41343275.pdf?src-supplier=element14+APAC; LCSC Part No: C504027
R10 R12 = RC0402FR-07100KL: 62.5mW Thick Film Resistors 50V ±100ppm/℃ ±1% 100kΩ 0402 Chip Resistor - Surface Mount ROHS; Manufacturer: Yageo Group; Max Power Dissipation: 63mW; Temperature Coefficient: 100ppm/°C; Supplier: Future Electronics; Supplier Part Number: RC0402FR-07100KL; Manufacturer Part Number: RC0402FR-07100KL; RoHS: Compliant; Category: Chip SMD Resistors; Stock: 11900000; Pricing: 30000=0.0005, 150000=0.0005, 400000=0.0005, 1000000=0.0005, 2500000=0.0005 (USD); Case/Package: 0402; Case Code (Imperial): 0402; Case Code (Metric): 0402; China RoHS: Non-Compliant; Composition: Thick Film; Contact Plating: Tin; Depth: 500µm; Features: Moisture Resistant; Height: 350µm; Lead Free: Lead Free; Length: 1mm; Lifecycle Status: Production; Max Operating Temperature: 155°C; Military Standard: Not; Min Operating Temperature: -55°C; Mounting Technology: Surface Mount; Pins: 2; Number of Terminals: 2; Number of Terminations: 2; Packaging: Cut Tape (CT); Power Rating: 62.5mW; Radiation Hardening: No; REACH SVHC: Yes; Value: 100kΩ; Schedule B: 8533210045, 8533210045|8533210045, 8533210045|8533210045|8533210045, 8533210045|8533210045|8533210045|8533210045; Termination: SMD/SMT; Tolerance: 1%; Voltage Rating: 50V; Voltage Rating (AC): 50V; Voltage Rating (DC): 50V; Width: 500µm; Working Voltage: 50V; ComponentLink1URL: https://datasheet.octopart.com:443/RC0402FR-07100KL-Yageo-datasheet-175887523.pdf?src-supplier=Newark; ComponentLink1Description: https://datasheet.octopart.com:443/RC0402FR-07100KL-Yageo-datasheet-175887523.pdf?src-supplier=Newark; ComponentLink2URL: https://datasheet.octopart.com:443/RC0402FR-07100KL-Yageo-datasheet-10408619.pdf?src-supplier=Newark; ComponentLink2Description: https://datasheet.octopart.com:443/RC0402FR-07100KL-Yageo-datasheet-10408619.pdf?src-supplier=Newark; ComponentLink3URL: https://datasheet.octopart.com:443/RC0402FR-07100KL-Yageo-datasheet-8324527.pdf?src-supplier=Newark; ComponentLink3Description: https://datasheet.octopart.com:443/RC0402FR-07100KL-Yageo-datasheet-8324527.pdf?src-supplier=Newark; ComponentLink4URL: https://datasheet.octopart.com:443/RC0402FR-07100KL-Yageo-datasheet-103092701.pdf?src-supplier=Upverter; ComponentLink4Description: https://datasheet.octopart.com:443/RC0402FR-07100KL-Yageo-datasheet-103092701.pdf?src-supplier=Upverter; ComponentLink5URL: https://datasheet.octopart.com:443/RC0402FR-07100KL-Yageo-datasheet-141435361.pdf?src-supplier=Upverter; ComponentLink5Description: https://datasheet.octopart.com:443/RC0402FR-07100KL-Yageo-datasheet-141435361.pdf?src-supplier=Upverter; ComponentLink6URL: https://datasheet.octopart.com:443/RC0402FR-07100KL-Yageo-datasheet-62067350.pdf?src-supplier=Farnell; ComponentLink6Description: https://datasheet.octopart.com:443/RC0402FR-07100KL-Yageo-datasheet-62067350.pdf?src-supplier=Farnell; ComponentLink7URL: https://datasheet.octopart.com:443/RC0402FR-07100KL-Yageo-datasheet-12531192.pdf?src-supplier=Future+Electronics; ComponentLink7Description: https://datasheet.octopart.com:443/RC0402FR-07100KL-Yageo-datasheet-12531192.pdf?src-supplier=Future+Electronics; ComponentLink8URL: https://datasheet.octopart.com:443/RC0402FR-07100KL-Yageo-Group-datasheet-176638170.pdf?src-supplier=Future+Electronics; ComponentLink8Description: https://datasheet.octopart.com:443/RC0402FR-07100KL-Yageo-Group-datasheet-176638170.pdf?src-supplier=Future+Electronics; ComponentLink9URL: https://datasheet.octopart.com:443/RC0402FR-07100KL-Yageo-datasheet-164759695.pdf?src-supplier=Future+Electronics; ComponentLink9Description: https://datasheet.octopart.com:443/RC0402FR-07100KL-Yageo-datasheet-164759695.pdf?src-supplier=Future+Electronics; ComponentLink10URL: https://datasheet.octopart.com:443/RC0402FR-07100KL-Yageo-datasheet-127823281.pdf?src-supplier=Future+Electronics; ComponentLink10Description: https://datasheet.octopart.com:443/RC0402FR-07100KL-Yageo-datasheet-127823281.pdf?src-supplier=Future+Electronics; ComponentLink11URL: https://datasheet.octopart.com:443/RC0402FR-07100KL-Yageo-datasheet-137700087.pdf?src-supplier=Future+Electronics; ComponentLink11Description: https://datasheet.octopart.com:443/RC0402FR-07100KL-Yageo-datasheet-137700087.pdf?src-supplier=Future+Electronics; ComponentLink12URL: https://datasheet.octopart.com:443/RC0402FR-07100KL-Yageo-datasheet-98239111.pdf?src-supplier=Future+Electronics; ComponentLink12Description: https://datasheet.octopart.com:443/RC0402FR-07100KL-Yageo-datasheet-98239111.pdf?src-supplier=Future+Electronics; ComponentLink13URL: https://datasheet.octopart.com:443/RC0402FR-07100KL-Yageo-datasheet-77992522.pdf?src-supplier=Future+Electronics; ComponentLink13Description: https://datasheet.octopart.com:443/RC0402FR-07100KL-Yageo-datasheet-77992522.pdf?src-supplier=Future+Electronics; ComponentLink14URL: https://datasheet.octopart.com:443/RC0402FR-07100KL-Yageo-datasheet-67302840.pdf?src-supplier=Future+Electronics; ComponentLink14Description: https://datasheet.octopart.com:443/RC0402FR-07100KL-Yageo-datasheet-67302840.pdf?src-supplier=Future+Electronics; ComponentLink15URL: https://datasheet.octopart.com:443/RC0402FR-07100KL-Yageo-datasheet-8324255.pdf?src-supplier=Future+Electronics; ComponentLink15Description: https://datasheet.octopart.com:443/RC0402FR-07100KL-Yageo-datasheet-8324255.pdf?src-supplier=Future+Electronics; ComponentLink16URL: https://datasheet.octopart.com:443/RC0402FR-07100KL-Yageo-datasheet-8329306.pdf?src-supplier=element14; ComponentLink16Description: https://datasheet.octopart.com:443/RC0402FR-07100KL-Yageo-datasheet-8329306.pdf?src-supplier=element14; ComponentLink17URL: https://datasheet.octopart.com:443/RC0402FR-07100KL-Yageo-datasheet-175423674.pdf?src-supplier=SOS+electronic; ComponentLink17Description: https://datasheet.octopart.com:443/RC0402FR-07100KL-Yageo-datasheet-175423674.pdf?src-supplier=SOS+electronic; ComponentLink18URL: https://datasheet.octopart.com:443/RC0402FR-07100KL-Yageo-datasheet-148775077.pdf?src-supplier=TME; ComponentLink18Description: https://datasheet.octopart.com:443/RC0402FR-07100KL-Yageo-datasheet-148775077.pdf?src-supplier=TME; ComponentLink19URL: https://datasheet.octopart.com:443/RC0402FR-07100KL-Yageo-datasheet-79472498.pdf?src-supplier=Megastar; ComponentLink19Description: https://datasheet.octopart.com:443/RC0402FR-07100KL-Yageo-datasheet-79472498.pdf?src-supplier=Megastar; ComponentLink20URL: https://datasheet.octopart.com/RC0402FR-07100KL-Yageo-datasheet-73766026.pdf; ComponentLink20Description: https://datasheet.octopart.com/RC0402FR-07100KL-Yageo-datasheet-73766026.pdf; ComponentLink21URL: http://sigma.octopart.com:80/conflict_mineral_statement/Yageo-company-3.pdf?src-supplier=Compliance+Statements; ComponentLink21Description: http://sigma.octopart.com:80/conflict_mineral_statement/Yageo-company-3.pdf?src-supplier=Compliance+Statements; ComponentLink22URL: http://sigma.octopart.com:80/rohs_statement/Yageo-company-2.pdf?src-supplier=Compliance+Statements; ComponentLink22Description: http://sigma.octopart.com:80/rohs_statement/Yageo-company-2.pdf?src-supplier=Compliance+Statements; LCSC Part No: C60491
R11 = RC0805FR-0724K9L: Res Thick Film 0402 24.9K Ohm 1% 0.063W(1/16W) ±100ppm/C Pad SMD T/R; Manufacturer: Yageo Group; Power Rating: 125mW; Value: 24.9kΩ; Temperature Coefficient: 100ppm/°C; Voltage Rating: 150V; Max Power Dissipation: 63mW; Voltage Rating (DC): 50V; Supplier: Future Electronics; Supplier Part Number: RC0805FR-0724K9L; Manufacturer Part Number: RC0805FR-0724K9L; RoHS: Compliant; Category: Chip SMD Resistors; Stock: 5000; Pricing: 15000=0.0017, 75000=0.0016, 150000=0.0016, 500000=0.0015, 1000000=0.0015 (USD); Case/Package: 0402; Case Code (Imperial): 0402; China RoHS: Non-Compliant; Composition: Thick Film; Depth: 1.25mm; Height: 500µm; Lead Free: Lead Free; Length: 2mm; Lifecycle Status: Production; Max Operating Temperature: 155°C; Manufacturer Package Identifier: RC0805FR-0724K9L; Military Standard: Not; Min Operating Temperature: -55°C; Mounting Technology: Surface Mount; Number of Terminals: 2; Packaging: Tape & Reel; REACH SVHC: Yes; Schedule B: 8533210045, 8533210045|8533210045, 8533210045|8533210045|8533210045, 8533210045|8533210045|8533210045|8533210045; Termination: SMD/SMT; Tolerance: 1%; Width: 1.25mm; Working Voltage: 150V; ComponentLink1URL: https://datasheet.octopart.com:443/RC0805FR-0724K9L-Yageo-datasheet-175887523.pdf?src-supplier=IHS; ComponentLink1Description: https://datasheet.octopart.com:443/RC0805FR-0724K9L-Yageo-datasheet-175887523.pdf?src-supplier=IHS; ComponentLink2URL: https://datasheet.octopart.com:443/RC0805FR-0724K9L-Yageo-datasheet-103092701.pdf?src-supplier=Upverter; ComponentLink2Description: https://datasheet.octopart.com:443/RC0805FR-0724K9L-Yageo-datasheet-103092701.pdf?src-supplier=Upverter; ComponentLink3URL: https://datasheet.octopart.com:443/RC0805FR-0724K9L-Yageo-Group-datasheet-189192902.pdf?src-supplier=TME; ComponentLink3Description: https://datasheet.octopart.com:443/RC0805FR-0724K9L-Yageo-Group-datasheet-189192902.pdf?src-supplier=TME; ComponentLink4URL: https://datasheet.octopart.com:443/RC0805FR-0724K9L-Yageo-Group-datasheet-176638170.pdf?src-supplier=Future+Electronics; ComponentLink4Description: https://datasheet.octopart.com:443/RC0805FR-0724K9L-Yageo-Group-datasheet-176638170.pdf?src-supplier=Future+Electronics; ComponentLink5URL: https://datasheet.octopart.com:443/RC0805FR-0724K9L-Yageo-datasheet-164759695.pdf?src-supplier=Future+Electronics; ComponentLink5Description: https://datasheet.octopart.com:443/RC0805FR-0724K9L-Yageo-datasheet-164759695.pdf?src-supplier=Future+Electronics; ComponentLink6URL: https://datasheet.octopart.com:443/RC0805FR-0724K9L-Yageo-datasheet-12592811.pdf?src-supplier=Future+Electronics; ComponentLink6Description: https://datasheet.octopart.com:443/RC0805FR-0724K9L-Yageo-datasheet-12592811.pdf?src-supplier=Future+Electronics; ComponentLink7URL: https://datasheet.octopart.com:443/RC0805FR-0724K9L-Yageo-datasheet-8330313.pdf?src-supplier=Future+Electronics; ComponentLink7Description: https://datasheet.octopart.com:443/RC0805FR-0724K9L-Yageo-datasheet-8330313.pdf?src-supplier=Future+Electronics; ComponentLink8URL: https://datasheet.octopart.com:443/RC0805FR-0724K9L-Yageo-datasheet-8324252.pdf?src-supplier=Future+Electronics; ComponentLink8Description: https://datasheet.octopart.com:443/RC0805FR-0724K9L-Yageo-datasheet-8324252.pdf?src-supplier=Future+Electronics; ComponentLink9URL: https://datasheet.octopart.com/RC0805FR-0724K9L-Yageo-datasheet-73766026.pdf; ComponentLink9Description: https://datasheet.octopart.com/RC0805FR-0724K9L-Yageo-datasheet-73766026.pdf; ComponentLink10URL: https://datasheet.octopart.com:443/RC0805FR-0724K9L-Yageo-datasheet-118657.pdf?src-supplier=DigiKey; ComponentLink10Description: https://datasheet.octopart.com:443/RC0805FR-0724K9L-Yageo-datasheet-118657.pdf?src-supplier=DigiKey; ComponentLink11URL: http://sigma.octopart.com:80/conflict_mineral_statement/Yageo-company-3.pdf?src-supplier=Compliance+Statements; ComponentLink11Description: http://sigma.octopart.com:80/conflict_mineral_statement/Yageo-company-3.pdf?src-supplier=Compliance+Statements; ComponentLink12URL: http://sigma.octopart.com:80/rohs_statement/Yageo-company-2.pdf?src-supplier=Compliance+Statements; ComponentLink12Description: http://sigma.octopart.com:80/rohs_statement/Yageo-company-2.pdf?src-supplier=Compliance+Statements; LCSC Part No: C138027; Contact Plating: Tin; Features: Moisture Resistant; Number of Terminations: 2; ComponentLink13URL: https://datasheet.octopart.com:443/RC0402FR-0724K9L-Yageo-datasheet-175887523.pdf?src-supplier=IHS; ComponentLink13Description: https://datasheet.octopart.com:443/RC0402FR-0724K9L-Yageo-datasheet-175887523.pdf?src-supplier=IHS; ComponentLink14URL: https://datasheet.octopart.com:443/RC0402FR-0724K9L-Yageo-datasheet-103092701.pdf?src-supplier=Upverter; ComponentLink14Description: https://datasheet.octopart.com:443/RC0402FR-0724K9L-Yageo-datasheet-103092701.pdf?src-supplier=Upverter; ComponentLink15URL: https://datasheet.octopart.com:443/RC0402FR-0724K9L-Yageo-datasheet-98239111.pdf?src-supplier=Upverter; ComponentLink15Description: https://datasheet.octopart.com:443/RC0402FR-0724K9L-Yageo-datasheet-98239111.pdf?src-supplier=Upverter; ComponentLink16URL: https://datasheet.octopart.com:443/RC0402FR-0724K9L-Yageo-datasheet-10408619.pdf?src-supplier=Newark; ComponentLink16Description: https://datasheet.octopart.com:443/RC0402FR-0724K9L-Yageo-datasheet-10408619.pdf?src-supplier=Newark; ComponentLink17URL: https://datasheet.octopart.com:443/RC0402FR-0724K9L-Yageo-datasheet-62067350.pdf?src-supplier=Newark; ComponentLink17Description: https://datasheet.octopart.com:443/RC0402FR-0724K9L-Yageo-datasheet-62067350.pdf?src-supplier=Newark; ComponentLink18URL: https://datasheet.octopart.com:443/RC0402FR-0724K9L-Yageo-Group-datasheet-176638170.pdf?src-supplier=Future+Electronics; ComponentLink18Description: https://datasheet.octopart.com:443/RC0402FR-0724K9L-Yageo-Group-datasheet-176638170.pdf?src-supplier=Future+Electronics; ComponentLink19URL: https://datasheet.octopart.com:443/RC0402FR-0724K9L-Yageo-datasheet-164759695.pdf?src-supplier=Future+Electronics; ComponentLink19Description: https://datasheet.octopart.com:443/RC0402FR-0724K9L-Yageo-datasheet-164759695.pdf?src-supplier=Future+Electronics; ComponentLink20URL: https://datasheet.octopart.com:443/RC0402FR-0724K9L-Yageo-datasheet-137700087.pdf?src-supplier=Future+Electronics; ComponentLink20Description: https://datasheet.octopart.com:443/RC0402FR-0724K9L-Yageo-datasheet-137700087.pdf?src-supplier=Future+Electronics; ComponentLink21URL: https://datasheet.octopart.com:443/RC0402FR-0724K9L-Yageo-datasheet-12531192.pdf?src-supplier=Future+Electronics; ComponentLink21Description: https://datasheet.octopart.com:443/RC0402FR-0724K9L-Yageo-datasheet-12531192.pdf?src-supplier=Future+Electronics; ComponentLink22URL: https://datasheet.octopart.com:443/RC0402FR-0724K9L-Yageo-datasheet-8324255.pdf?src-supplier=Future+Electronics; ComponentLink22Description: https://datasheet.octopart.com:443/RC0402FR-0724K9L-Yageo-datasheet-8324255.pdf?src-supplier=Future+Electronics; ComponentLink23URL: https://datasheet.octopart.com:443/RC0402FR-0724K9L-Yageo-Group-datasheet-190382422.pdf?src-supplier=Farnell; ComponentLink23Description: https://datasheet.octopart.com:443/RC0402FR-0724K9L-Yageo-Group-datasheet-190382422.pdf?src-supplier=Farnell; ComponentLink24URL: https://datasheet.octopart.com:443/RC0402FR-0724K9L-Yageo-datasheet-148775077.pdf?src-supplier=TME; ComponentLink24Description: https://datasheet.octopart.com:443/RC0402FR-0724K9L-Yageo-datasheet-148775077.pdf?src-supplier=TME; ComponentLink25URL: https://datasheet.octopart.com/RC0402FR-0724K9L-Yageo-datasheet-73766026.pdf; ComponentLink25Description: https://datasheet.octopart.com/RC0402FR-0724K9L-Yageo-datasheet-73766026.pdf